# Altium schematic sheet Power.SchDoc
size A4
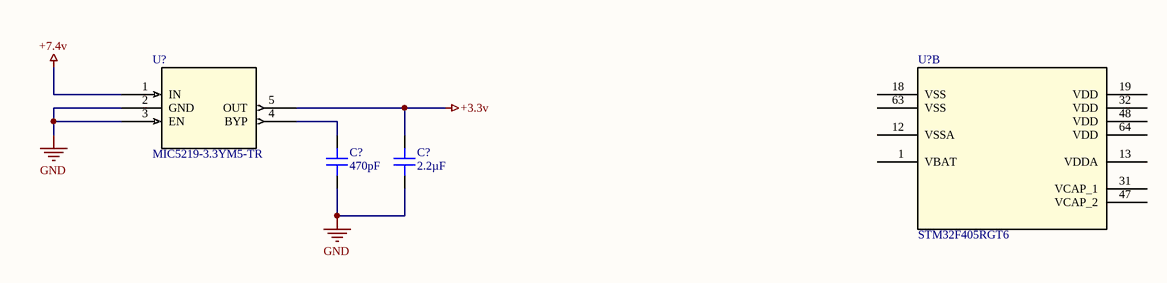
[diagram p0: Power.SchDoc]

## Parts
(Parts that share a designator on the sheet are numbered #1, #2 ... from top to bottom, then left to right.)
C?#1  470pF  [CAP 0805_2012]
C?#2  2.2µF  [CAP 0805_2012]
U?#1  MIC5219-3.3YM5-TR  [SOT-23-5_M5_MCH]
U?#2  STM32F405RGT6  [LQFP64-10x10mm]  (part B of 2)

## Nets
+3.3v: C?#2.2 U?#1.5(OUT)
+7.4v: U?#1.1(IN)
GND: C?#1.1 C?#2.1 U?#1.2(GND) U?#1.3(EN)
NetC?#1_2: C?#1.2 U?#1.4(BYP)

Not connected (* = marked no-connect by the designer): U?#2 1(VBAT) 12(VSSA) 13(VDDA) 18(VSS) 19(VDD) 31(VCAP_1) 32(VDD) 47(VCAP_2) 48(VDD) 63(VSS) 64(VDD)

## Library data of the parts
C?#1 = C0805C471K3RAC7800: CAP CER 470PF 25V X7R 0805; Manufacturer: KEMET; Tolerance: ±10%; Part Number: C0805C471K3RAC7800; Value: 470pF; Applications: Bypass, Decoupling; Capacitance: 470pF; ComponentLink1Description: Datasheet; ComponentLink1URL: https://api.kemet.com/component-edge/download/datasheet/C0805C471K3RACTU.pdf; ComponentLink2Description: DigiKey Link; ComponentLink2URL: http://digikey.com/product-detail/en/kemet/C0805C471K3RAC7800/399-15502-1-ND/7386900; Device Package: 0805 (2012 Metric); LastUpdated: 9/2/2020 1:04:24 AM; Lifecycle Status: Active; Minimum Order: 1; Mounting Type: Surface Mount, MLCC; Operating Temperature: -55°C ~ 125°C; Package / Case: 0805 (2012 Metric); Packaging: TapeAndReel; PartId: 12410; Part Status: Active; Price: 0.06; Series: SMD Comm X7R; Size / Dimension: 0.079" L x 0.049" W (2.00mm x 1.25mm); Supplier 1: DigiKey; Supplier Part Number 1: 399-15502-1-ND; Temperature Coefficient: X7R; Thickness (Max): 0.035" (0.88mm); Voltage - Rated: 25V
C?#2 = C2012X7R1E225M085AB: CAP CER 2.2UF 25V X7R 0805; Manufacturer: TDK Corporation; Tolerance: ±20%; Part Number: C2012X7R1E225M085AB; Value: 2.2µF; Applications: General Purpose; Capacitance: 2.2µF; ComponentLink1Description: Datasheet; ComponentLink1URL: https://product.tdk.com/info/en/catalog/datasheets/mlcc_commercial_general_en.pdf?ref_disty=digikey; ComponentLink2Description: DigiKey Link; ComponentLink2URL: http://digikey.com/product-detail/en/tdk-corporation/C2012X7R1E225M085AB/445-14536-1-ND/3956202; Device Package: 0805 (2012 Metric); Features: Low ESL; LastUpdated: 9/2/2020 1:04:41 AM; Lifecycle Status: Active; Minimum Order: 1; Mounting Type: Surface Mount, MLCC; Operating Temperature: -55°C ~ 125°C; Package / Case: 0805 (2012 Metric); Packaging: TapeAndReel; PartId: 3013; Part Status: Active; Price: 0.09; Series: C; Size / Dimension: 0.079" L x 0.049" W (2.00mm x 1.25mm); Supplier 1: DigiKey; Supplier Part Number 1: 445-14536-1-ND; Temperature Coefficient: X7R; Thickness (Max): 0.039" (1.00mm); Voltage - Rated: 25V
U?#1 = MIC5219-3.3YM5-TR: No Description Available; Vendor: Microchip; Built_By: EMA_Jessica; SourceLibrary: Microchip_2019-08-23_3; Manufacturer_Part_Number: MIC5219-3.3YM5-TR; Copyright: Copyright (C) 2018 Accelerated Designs. All rights reserved; RefDes: RefDes; Type: DEV
U?#2 = STM32F405RGT6: No Description Available; Vendor: STMicroelectronics; Built_By: EMA_UL_Team; SourceLibrary: Updates_to_database_2020-10-19; Manufacturer_Part_Number: STM32F405RGT6; Copyright: Copyright (C) 2018 Accelerated Designs. All rights reserved; RefDes: RefDes; Type: DEV